# Altium schematic sheet CP2102.SchDoc
size A; Author: Erick Miranda Quinde; DrawnBy: Erick Miranda Quinde; DocumentNumber: 0000-0000-0003; Revision: V1.0; SheetNumber: 3; SheetTotal: 4
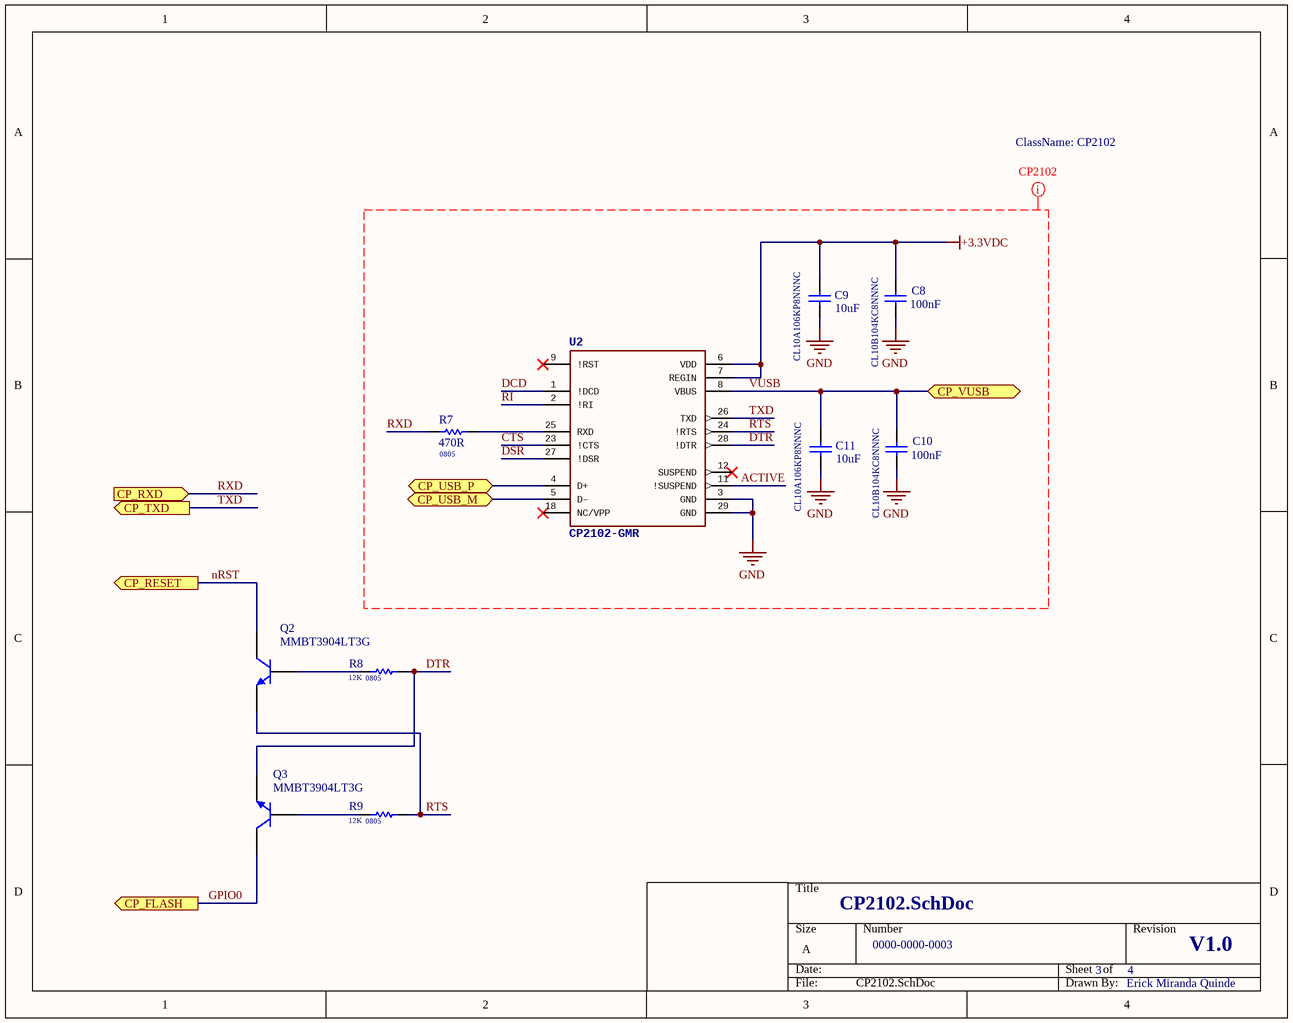
[diagram p0: CP2102.SchDoc]

## Parts
C8  CL10B104KC8NNNC  value 100nF  [C0603C104K5RACTU]
C9  CL10A106KP8NNNC  value 10uF  [C0603C104K5RACTU]
C10  CL10B104KC8NNNC  value 100nF  [C0603C104K5RACTU]
C11  CL10A106KP8NNNC  value 10uF  [C0603C104K5RACTU]
Q2  MMBT3904LT3G  [SOT-23-TT3_N]
Q3  MMBT3904LT3G  [SOT-23-TT3_N]
R7  value 470R  Package: 0805  [RES-0805]  (hidden comment: 0805W8F4700T5E)
R8  value 12K  Package: 0805  [RES-0805]  (hidden comment: 0805W8F1202T5E)
R9  value 12K  Package: 0805  [RES-0805]  (hidden comment: 0805W8F1202T5E)
U2  CP2102-GMR  [QFN50P500X500X100-29N]

## Ports
CP_FLASH (out), CP_RESET (out), CP_RXD (in), CP_TXD (out), CP_USB_M (bidir), CP_USB_P (bidir), CP_VUSB

## Nets
+3.3VDC: C8.2 C9.2 U2.6(VDD) U2.7(REGIN)
GND: C8.1 C9.1 C10.1 C11.1 U2.3(GND) U2.29(GND)
ACTIVE: U2.11(!SUSPEND)
CP_USB_M: U2.5(D–) ; port CP_USB_M
CP_USB_P: U2.4(D+) ; port CP_USB_P
CTS: U2.23(!CTS)
DCD: U2.1(!DCD)
DSR: U2.27(!DSR)
DTR: Q3.2(E) R8.2 U2.28(!DTR)
GPIO0: Q3.3(C) ; port CP_FLASH
nRST: Q2.3(C) ; port CP_RESET
RI: U2.2(!RI)
RTS: Q2.2(E) R9.2 U2.24(!RTS)
RXD: R7.1 ; port CP_RXD
TXD: U2.26(TXD) ; port CP_TXD
VUSB: C10.2 C11.2 U2.8(VBUS) ; port CP_VUSB
NetQ2_1: Q2.1(B) R8.1
NetQ3_1: Q3.1(B) R9.1
NetR7_2: R7.2 U2.25(RXD)

Not connected (* = marked no-connect by the designer): U2 9(!RST)* 12(SUSPEND)* 18(NC/VPP)*

## Layout directives
net class CP2102: +3.3VDC, ACTIVE, CTS, DCD, DSR, DTR, GND, RI, RTS, RXD, TXD, VUSB

## Library data of the parts
C8-C11 = Cap 100nF (0603)
  C8 C10: PART_NUM: CL10B104KC8NNNC; Price: $0.02; Link Store: https://lcsc.com/product-detail/Multilayer-Ceramic-Capacitors-MLCC-SMD-SMT_SAMSUNG_CL10B104KC8NNNC_100nF-104-10-100V_C15725.html; LCSC Part: C15725
  C9 C11: PART_NUM: CL10A106KP8NNNC; Price: $0.04; Link Store: https://lcsc.com/product-detail/Multilayer-Ceramic-Capacitors-MLCC-SMD-SMT_Samsung-Electro-Mechanics-CL10A106KP8NNNC_C19702.html; LCSC Part: C19702
Q2 Q3 = 2N3904: Price: $0.019; Link Store: https://lcsc.com/product-detail/Transistors-NPN-PNP_ON-Semiconductor-ON-MMBT3904LT3G_C150052.html; LCSC Part: C150052
R7-R9 = Resistor: Published: 8-Jun-2000; LatestRevisionDate: 17-Jul-2002; LatestRevisionNote: Re-released for DXP Platform.; PackageReference: AXIAL-0.3; Publisher: Altium Limited; PackageDescription: Axial Device, Thru-Hole; 2 Leads; 0.3 in Pin Spacing
  R7: Price: $0.0025; Link Store: https://lcsc.com/product-detail/Chip-Resistor-Surface-Mount_UNI-ROYAL-Uniroyal-Elec-0805W8F4700T5E_C17710.html; LCSC Part: C17710
  R8 R9: Price: $0.029; Link Store: https://lcsc.com/product-detail/Chip-Resistor-Surface-Mount_UNI-ROYAL-Uniroyal-Elec-0805W8F1202T5E_C17444.html; LCSC Part: C17444
U2 = CP2102-GM: MF: Silicon Labs; Package: VFQFN-28 Vishay Siliconix; Price: $1.6; Availability: Unavailable; MP: CP2102-GMR; Link Store: https://lcsc.com/product-detail/USB-ICs_SILICON-LABS_CP2102-GMR_SILICON-LABS-CP2102-GMR_C6568.html; LCSC Part: C6568